# Altium project BCS1_REV2.2.PrjPcb (part 2 of 2)
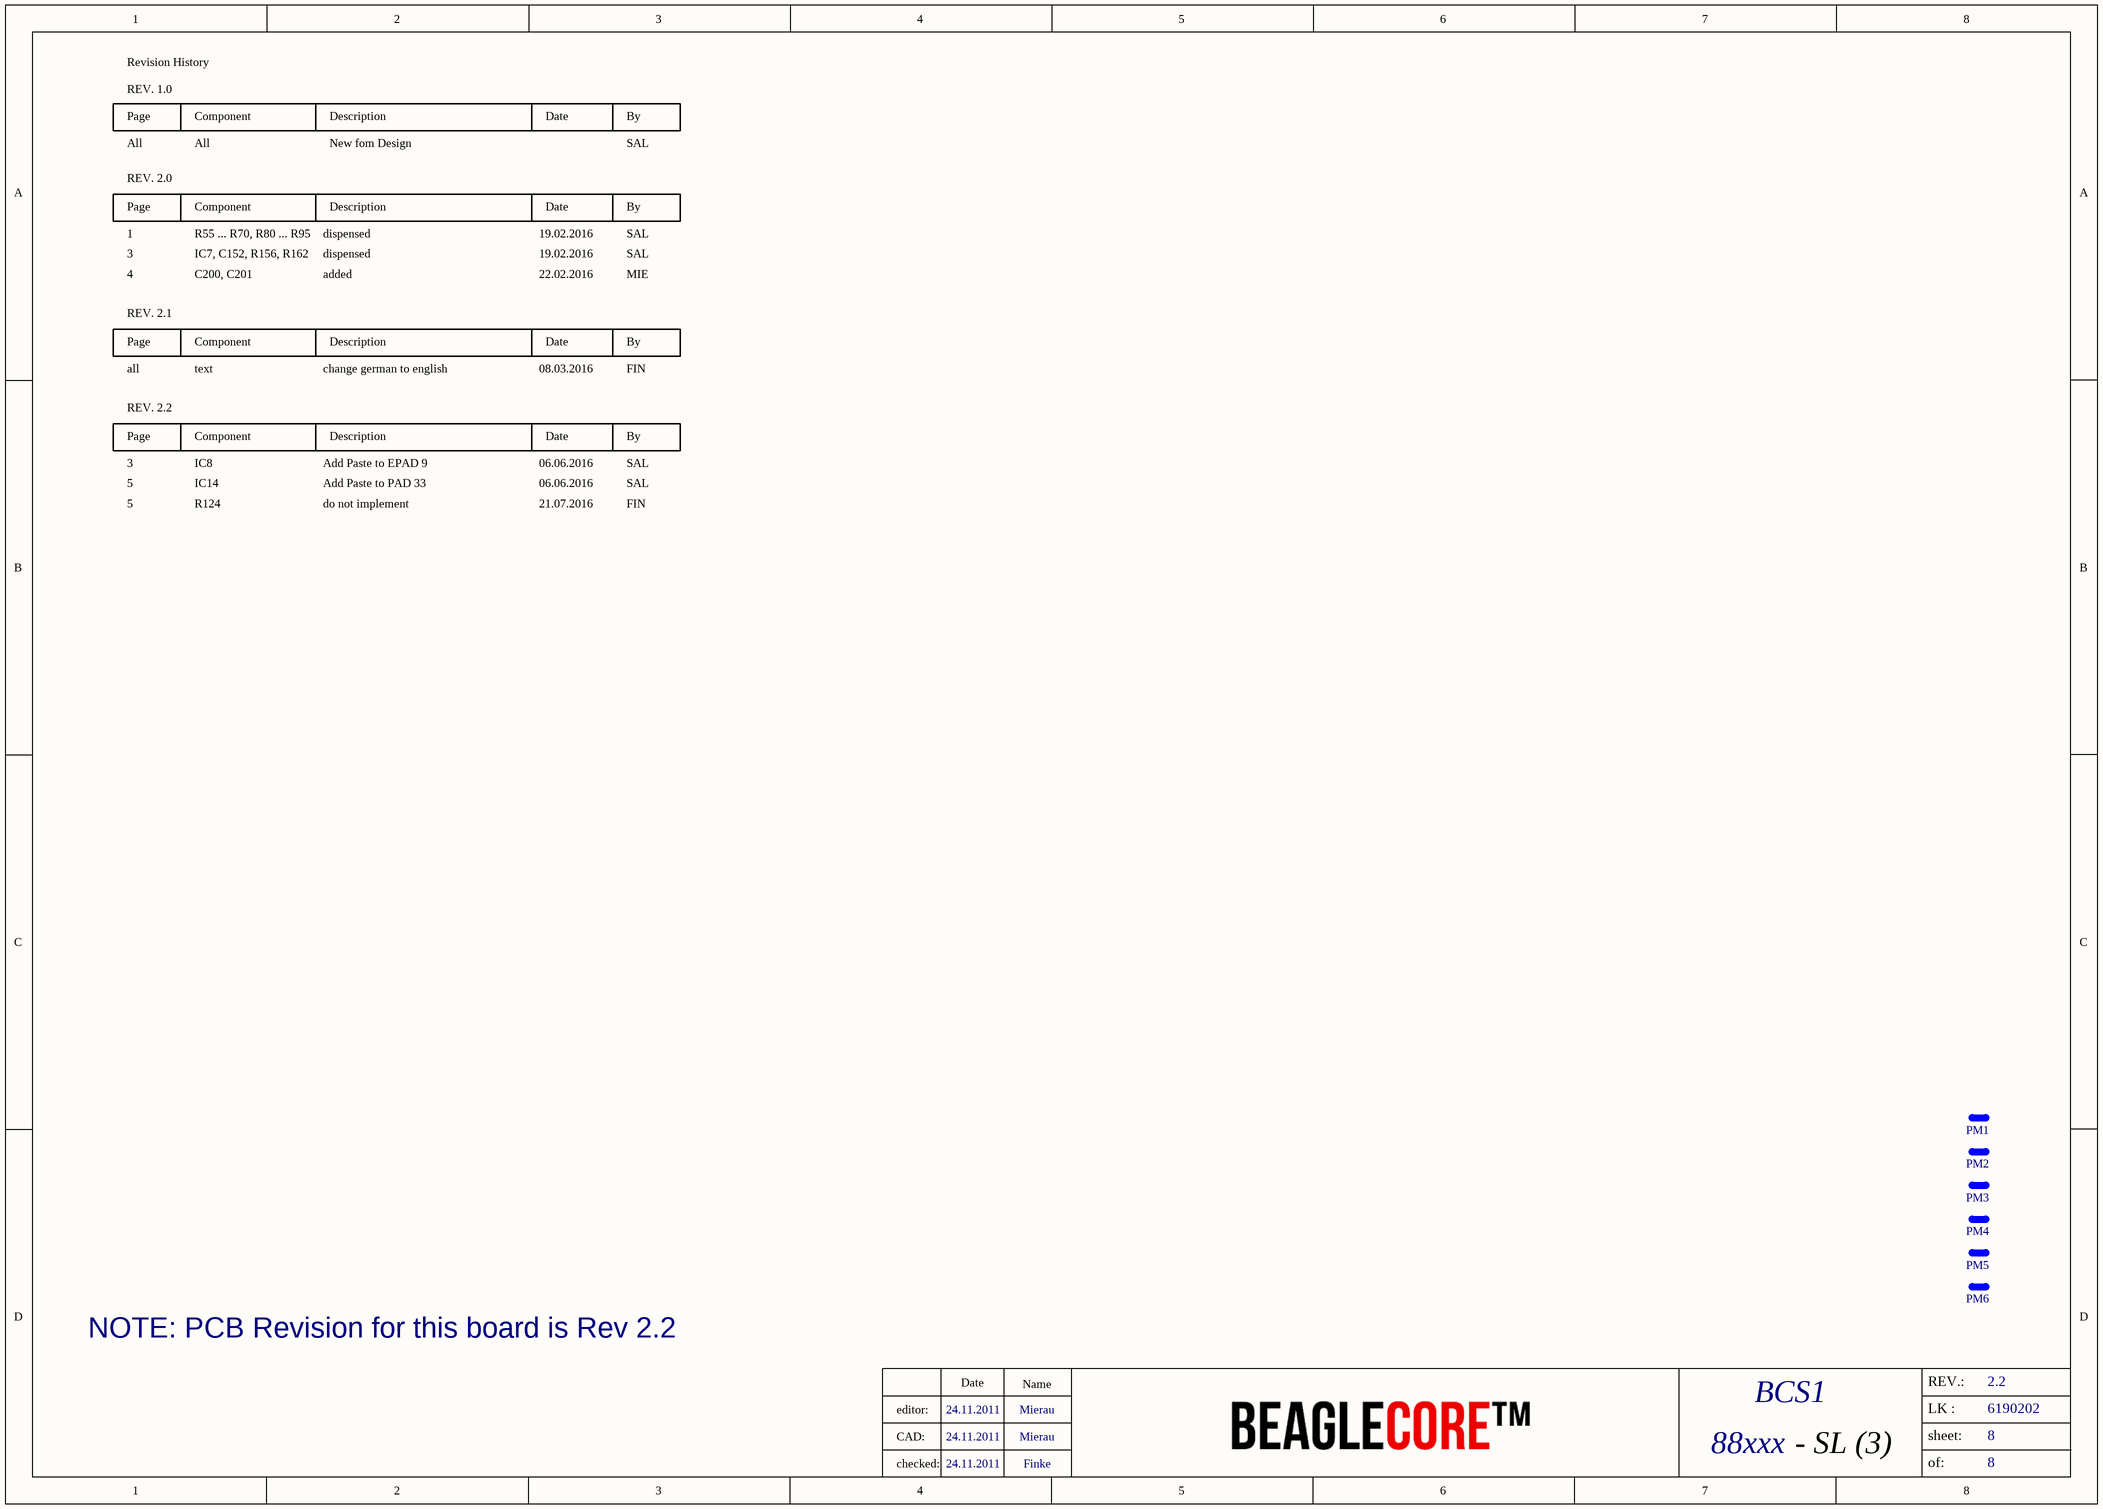
[diagram p8: P08_BCS1_Revision Page.SchDoc]

## Nets that join several sheets
DGND: P01_BCS1_Power BBCore (13 pins), P02_BCS1_JTAG, Clock, LED (23 pins), P03_BCS1_USB, Serial, uSD (20 pins), P04_BCS1_Core Connector (29 pins), P05_BCS1_Ethernet (28 pins), P06_BCS1_HDMI Framer (47 pins), P07_BCS1_Exp Conn (8 pins)
GNDA_ADC: P04_BCS1_Core Connector (BG1.55 BG1.80 BG1.G5), P07_BCS1_Exp Conn (XB9.34)
PE1: P01_BCS1_Power BBCore (BEF1.1 BEF3.1), P03_BCS1_USB, Serial, uSD (6 pins), P05_BCS1_Ethernet (R136.2 R163.2 XB5.15 XB5.16)
PE2: P01_BCS1_Power BBCore (BEF2.1 BEF4.1), P03_BCS1_USB, Serial, uSD (8 pins), P06_BCS1_HDMI Framer (XB6.20 XB6.21 XB6.22 XB6.23)
SYS_5V: P02_BCS1_JTAG, Clock, LED (R71.1 R72.1 R73.1 R74.1), P03_BCS1_USB, Serial, uSD (C34.2 IC8.2 IC8.3), P04_BCS1_Core Connector (BG1.B4), P06_BCS1_HDMI Framer (RT1.1), P07_BCS1_Exp Conn (XB9.7 XB9.8)
VDD_1V8: P04_BCS1_Core Connector (BG1.C3 BG1.C4), P06_BCS1_HDMI Framer (L3.2)
VDD_3V3A: P01_BCS1_Power BBCore (LD1.2), P02_BCS1_JTAG, Clock, LED (8 pins), P03_BCS1_USB, Serial, uSD (R52.2), P04_BCS1_Core Connector (BG1.G1)
VDD_3V3B: P02_BCS1_JTAG, Clock, LED (C29.2 R23.1 R24.1 XS2.5), P03_BCS1_USB, Serial, uSD (13 pins), P04_BCS1_Core Connector (BG1.B1 BG1.C1), P05_BCS1_Ethernet (7 pins), P06_BCS1_HDMI Framer (R158.1 R166.2), P07_BCS1_Exp Conn (XB9.3 XB9.4)
VDD_5V: P01_BCS1_Power BBCore (XS1.1), P04_BCS1_Core Connector (BG1.A4 BG1.A5), P07_BCS1_Exp Conn (XB9.5 XB9.6)
VDD_ADC: P04_BCS1_Core Connector (BG1.81 BG1.H5), P07_BCS1_Exp Conn (XB9.32)
VDD_USB_DC: P03_BCS1_USB, Serial, uSD (C36.1 DA10.6 R159.1 XB4.1), P04_BCS1_Core Connector (BG1.B5 TP23.1)
12MHZ: P02_BCS1_JTAG, Clock, LED (R21.2), P06_BCS1_HDMI Framer (IC11.27)
AIN0: P04_BCS1_Core Connector (BG1.59), P07_BCS1_Exp Conn (XB9.39)
AIN1: P04_BCS1_Core Connector (BG1.84), P07_BCS1_Exp Conn (XB9.40)
AIN2: P04_BCS1_Core Connector (BG1.58), P07_BCS1_Exp Conn (XB9.37)
AIN3: P04_BCS1_Core Connector (BG1.83), P07_BCS1_Exp Conn (XB9.38)
AIN4: P04_BCS1_Core Connector (BG1.57), P07_BCS1_Exp Conn (XB9.33)
AIN5: P04_BCS1_Core Connector (BG1.82), P07_BCS1_Exp Conn (XB9.36)
AIN6: P04_BCS1_Core Connector (BG1.56), P07_BCS1_Exp Conn (XB9.35)
BAT1: P01_BCS1_Power BBCore (TP5.1), P04_BCS1_Core Connector (BG1.60)
BAT_SENSE: P01_BCS1_Power BBCore (TP6.1), P04_BCS1_Core Connector (BG1.61)
BAT_TS: P01_BCS1_Power BBCore (TP7.1), P04_BCS1_Core Connector (BG1.62)
CLKOUT2: P02_BCS1_JTAG, Clock, LED (R19.2 R20.1 XS2.18), P07_BCS1_Exp Conn (XB9.41)
CLKOUT_SRC: P02_BCS1_JTAG, Clock, LED (R19.1), P04_BCS1_Core Connector (BG1.76)
EHRPWM1A: P04_BCS1_Core Connector (BG1.38), P07_BCS1_Exp Conn (XB9.14)
EHRPWM1B: P04_BCS1_Core Connector (BG1.39), P07_BCS1_Exp Conn (XB9.16)
EHRPWM2A: P04_BCS1_Core Connector (BG1.154), P07_BCS1_Exp Conn (XB8.19)
EHRPWM2B: P04_BCS1_Core Connector (BG1.155), P07_BCS1_Exp Conn (XB8.13)
GPIO0_7: P03_BCS1_USB, Serial, uSD (R50.1 R51.1), P07_BCS1_Exp Conn (XB9.42)
GPIO0_7SRC: P03_BCS1_USB, Serial, uSD (R50.2), P04_BCS1_Core Connector (BG1.68)
GPIO0_26: P04_BCS1_Core Connector (BG1.133), P07_BCS1_Exp Conn (XB8.14)
GPIO0_27: P04_BCS1_Core Connector (BG1.134), P07_BCS1_Exp Conn (XB8.17)
GPIO1_12: P04_BCS1_Core Connector (BG1.162), P07_BCS1_Exp Conn (XB8.12)
GPIO1_13: P04_BCS1_Core Connector (BG1.137), P07_BCS1_Exp Conn (XB8.11)
GPIO1_14: P04_BCS1_Core Connector (BG1.163), P07_BCS1_Exp Conn (XB8.16)
GPIO1_15: P04_BCS1_Core Connector (BG1.138), P07_BCS1_Exp Conn (XB8.15)
GPIO1_16: P02_BCS1_JTAG, Clock, LED (R160.2 R161.2), P07_BCS1_Exp Conn (XB9.15)
GPIO1_17: P04_BCS1_Core Connector (BG1.160), P07_BCS1_Exp Conn (XB9.23)
GPIO1_28: P04_BCS1_Core Connector (BG1.37), P07_BCS1_Exp Conn (XB9.12)
GPIO1_29: P04_BCS1_Core Connector (BG1.153), P07_BCS1_Exp Conn (XB8.26)
GPIO2_1: P04_BCS1_Core Connector (BG1.158), P07_BCS1_Exp Conn (XB8.18)
GPIO3_18: P03_BCS1_USB, Serial, uSD (R51.2), P04_BCS1_Core Connector (BG1.85)
GPIO3_19: P04_BCS1_Core Connector (BG1.86), P07_BCS1_Exp Conn (XB9.27)
GPIO3_20: P02_BCS1_JTAG, Clock, LED (R20.2), P04_BCS1_Core Connector (BG1.87)
GPIO3_21: P02_BCS1_JTAG, Clock, LED (R167.2), P04_BCS1_Core Connector (BG1.88), P07_BCS1_Exp Conn (XB9.25)
GPIO_1_16: P02_BCS1_JTAG, Clock, LED (R160.1), P04_BCS1_Core Connector (BG1.139)
GPIO_2_0: P02_BCS1_JTAG, Clock, LED (R161.1), P04_BCS1_Core Connector (BG1.159)
HDMI_INT: P04_BCS1_Core Connector (BG1.135), P06_BCS1_HDMI Framer (IC11.50 R158.2)
HDMICLK_DISn: P02_BCS1_JTAG, Clock, LED (IC9.2 R96.1), P04_BCS1_Core Connector (BG1.136)
I2C0_SCL: P04_BCS1_Core Connector (BG1.32), P06_BCS1_HDMI Framer (IC11.52)
I2C0_SDA: P04_BCS1_Core Connector (BG1.33), P06_BCS1_HDMI Framer (IC11.51)
I2C1_SCL: P04_BCS1_Core Connector (BG1.50), P07_BCS1_Exp Conn (XB9.17)
I2C1_SDA: P04_BCS1_Core Connector (BG1.49), P07_BCS1_Exp Conn (XB9.18)
I2C2_SCL: P04_BCS1_Core Connector (BG1.72), P07_BCS1_Exp Conn (XB9.19)
I2C2_SDA: P04_BCS1_Core Connector (BG1.71), P07_BCS1_Exp Conn (XB9.20)
JTAG_EMU0: P02_BCS1_JTAG, Clock, LED (R23.2 XS2.13), P04_BCS1_Core Connector (BG1.77)
JTAG_EMU1: P02_BCS1_JTAG, Clock, LED (R24.2 XS2.14), P04_BCS1_Core Connector (BG1.51)
JTAG_TCK: P02_BCS1_JTAG, Clock, LED (XS2.9 XS2.11), P04_BCS1_Core Connector (BG1.52)
JTAG_TDI: P02_BCS1_JTAG, Clock, LED (XS2.3), P04_BCS1_Core Connector (BG1.78)
JTAG_TDO: P02_BCS1_JTAG, Clock, LED (XS2.7), P04_BCS1_Core Connector (BG1.53)
JTAG_TMS: P02_BCS1_JTAG, Clock, LED (XS2.1), P04_BCS1_Core Connector (BG1.79)
JTAG_TRSTn: P02_BCS1_JTAG, Clock, LED (R25.1 XS2.2), P04_BCS1_Core Connector (BG1.54)
LCD_DATA0: P04_BCS1_Core Connector (BG1.94), P06_BCS1_HDMI Framer (C173.1 IC11.15), P07_BCS1_Exp Conn (XB8.45)
LCD_DATA1: P04_BCS1_Core Connector (BG1.111), P06_BCS1_HDMI Framer (C171.1 IC11.13), P07_BCS1_Exp Conn (XB8.46)
LCD_DATA2: P01_BCS1_Power BBCore (R75.1), P04_BCS1_Core Connector (BG1.95), P06_BCS1_HDMI Framer (C172.1 IC11.12), P07_BCS1_Exp Conn (XB8.43)
LCD_DATA3: P04_BCS1_Core Connector (BG1.112), P06_BCS1_HDMI Framer (C170.1 IC11.11), P07_BCS1_Exp Conn (XB8.44)
LCD_DATA4: P04_BCS1_Core Connector (BG1.96), P06_BCS1_HDMI Framer (C169.1 IC11.10), P07_BCS1_Exp Conn (XB8.41)
LCD_DATA5: P04_BCS1_Core Connector (BG1.113), P06_BCS1_HDMI Framer (C163.1 IC11.7), P07_BCS1_Exp Conn (XB8.42)
LCD_DATA6: P04_BCS1_Core Connector (BG1.97), P06_BCS1_HDMI Framer (C162.1 IC11.6), P07_BCS1_Exp Conn (XB8.39)
LCD_DATA7: P04_BCS1_Core Connector (BG1.114), P06_BCS1_HDMI Framer (C161.1 IC11.3), P07_BCS1_Exp Conn (XB8.40)
LCD_DATA8: P04_BCS1_Core Connector (BG1.98), P06_BCS1_HDMI Framer (C160.1 IC11.2), P07_BCS1_Exp Conn (XB8.37)
LCD_DATA9: P04_BCS1_Core Connector (BG1.115), P06_BCS1_HDMI Framer (C157.1 IC11.1), P07_BCS1_Exp Conn (XB8.38)
LCD_DATA10: P04_BCS1_Core Connector (BG1.99), P06_BCS1_HDMI Framer (C156.1 IC11.64), P07_BCS1_Exp Conn (XB8.36)
LCD_DATA11: P04_BCS1_Core Connector (BG1.116), P06_BCS1_HDMI Framer (C168.1 IC11.60), P07_BCS1_Exp Conn (XB8.34)
LCD_DATA12: P04_BCS1_Core Connector (BG1.100), P06_BCS1_HDMI Framer (C167.1 IC11.59), P07_BCS1_Exp Conn (XB8.35)
LCD_DATA13: P04_BCS1_Core Connector (BG1.117), P06_BCS1_HDMI Framer (C166.1 IC11.58), P07_BCS1_Exp Conn (XB8.33)
LCD_DATA14: P04_BCS1_Core Connector (BG1.101), P06_BCS1_HDMI Framer (C165.1 IC11.57), P07_BCS1_Exp Conn (XB8.31)
LCD_DATA15: P04_BCS1_Core Connector (BG1.118), P06_BCS1_HDMI Framer (C164.1 IC11.56), P07_BCS1_Exp Conn (XB8.32)
LCD_DE: P06_BCS1_HDMI Framer (IC11.20 R48.2), P07_BCS1_Exp Conn (XB8.30)
LCD_HSYNC: P06_BCS1_HDMI Framer (IC11.22 R47.2), P07_BCS1_Exp Conn (XB8.29)
LCD_PCLK: P06_BCS1_HDMI Framer (IC11.4 R45.2), P07_BCS1_Exp Conn (XB8.28)
LCD_VSYNC: P06_BCS1_HDMI Framer (IC11.21 R46.2), P07_BCS1_Exp Conn (XB8.27)
LCDDE: P04_BCS1_Core Connector (BG1.120), P06_BCS1_HDMI Framer (R48.1)
LCDPCLK: P04_BCS1_Core Connector (BG1.144), P06_BCS1_HDMI Framer (R45.1)
LCDVHYNC: P04_BCS1_Core Connector (BG1.145), P06_BCS1_HDMI Framer (R47.1)
LCDVSYNC: P04_BCS1_Core Connector (BG1.146), P06_BCS1_HDMI Framer (R46.1)
MDIO_CLK: P04_BCS1_Core Connector (BG1.20), P05_BCS1_Ethernet (IC14.17)
MDIO_DATA: P04_BCS1_Core Connector (BG1.19), P05_BCS1_Ethernet (IC14.16 R119.1)
MII1_COL: P04_BCS1_Core Connector (BG1.12), P05_BCS1_Ethernet (R138.1)
MII1_CRS_DV: P04_BCS1_Core Connector (BG1.28), P05_BCS1_Ethernet (R139.1)
MII1_REFCLK: P04_BCS1_Core Connector (BG1.11), P05_BCS1_Ethernet (R124.1 R140.1)
MII1_RXCLK: P04_BCS1_Core Connector (BG1.6), P05_BCS1_Ethernet (R131.1)
MII1_RXD0: P04_BCS1_Core Connector (BG1.21), P05_BCS1_Ethernet (R128.1)
MII1_RXD1: P04_BCS1_Core Connector (BG1.22), P05_BCS1_Ethernet (R127.1)
MII1_RXD2: P04_BCS1_Core Connector (BG1.4), P05_BCS1_Ethernet (R126.1)
MII1_RXD3: P04_BCS1_Core Connector (BG1.5), P05_BCS1_Ethernet (R125.1)
MII1_RXDV: P04_BCS1_Core Connector (BG1.9), P05_BCS1_Ethernet (R129.1)
MII1_RXERR: P04_BCS1_Core Connector (BG1.27), P05_BCS1_Ethernet (R133.1)
MII1_TXCLK: P04_BCS1_Core Connector (BG1.23), P05_BCS1_Ethernet (R134.1)
MII1_TXD0: P04_BCS1_Core Connector (BG1.24), P05_BCS1_Ethernet (IC14.22)
MII1_TXD1: P04_BCS1_Core Connector (BG1.7), P05_BCS1_Ethernet (IC14.23)
MII1_TXD2: P04_BCS1_Core Connector (BG1.25), P05_BCS1_Ethernet (IC14.24)
MII1_TXD3: P04_BCS1_Core Connector (BG1.8), P05_BCS1_Ethernet (IC14.25)
MII1_TXEN: P04_BCS1_Core Connector (BG1.10), P05_BCS1_Ethernet (IC14.21)
MMC0_CD: P02_BCS1_JTAG, Clock, LED (XS2.19), P03_BCS1_USB, Serial, uSD (R157.2 XB10.10), P04_BCS1_Core Connector (BG1.42)
MMC0_CLKO: P03_BCS1_USB, Serial, uSD (R152.2 XB10.5), P04_BCS1_Core Connector (BG1.65)
MMC0_CMD: P03_BCS1_USB, Serial, uSD (R151.2 XB10.3), P04_BCS1_Core Connector (BG1.64)
MMC0_DAT0: P03_BCS1_USB, Serial, uSD (R153.2 XB10.7), P04_BCS1_Core Connector (BG1.67)
MMC0_DAT1: P03_BCS1_USB, Serial, uSD (R154.2 XB10.8), P04_BCS1_Core Connector (BG1.41)
MMC0_DAT2: P03_BCS1_USB, Serial, uSD (R150.2 XB10.1), P04_BCS1_Core Connector (BG1.66)
MMC0_DAT3: P03_BCS1_USB, Serial, uSD (R155.2 XB10.2), P04_BCS1_Core Connector (BG1.40)
MMC1_CLK: P04_BCS1_Core Connector (BG1.131), P07_BCS1_Exp Conn (XB8.21)
MMC1_CMD: P04_BCS1_Core Connector (BG1.156), P07_BCS1_Exp Conn (XB8.20)
MMC1_DAT0: P04_BCS1_Core Connector (BG1.123), P07_BCS1_Exp Conn (XB8.25)
MMC1_DAT1: P04_BCS1_Core Connector (BG1.124), P07_BCS1_Exp Conn (XB8.24)
MMC1_DAT2: P04_BCS1_Core Connector (BG1.125), P07_BCS1_Exp Conn (XB8.5)
MMC1_DAT3: P04_BCS1_Core Connector (BG1.126), P07_BCS1_Exp Conn (XB8.6)
MMC1_DAT4: P04_BCS1_Core Connector (BG1.127), P07_BCS1_Exp Conn (XB8.23)
MMC1_DAT5: P04_BCS1_Core Connector (BG1.128), P07_BCS1_Exp Conn (XB8.22)
MMC1_DAT6: P04_BCS1_Core Connector (BG1.129), P07_BCS1_Exp Conn (XB8.3)
MMC1_DAT7: P04_BCS1_Core Connector (BG1.130), P07_BCS1_Exp Conn (XB8.4)
PWR_BUT: P01_BCS1_Power BBCore (TA3.2 TA3.3), P04_BCS1_Core Connector (BG1.63), P07_BCS1_Exp Conn (XB9.9)
SPI1_CS0: P04_BCS1_Core Connector (BG1.106), P06_BCS1_HDMI Framer (IC11.25), P07_BCS1_Exp Conn (XB9.28)
SPI1_D0: P04_BCS1_Core Connector (BG1.104), P06_BCS1_HDMI Framer (IC11.24), P07_BCS1_Exp Conn (XB9.29)
SPI1_D1: P04_BCS1_Core Connector (BG1.105), P07_BCS1_Exp Conn (XB9.30)
SPI1_SCLK: P04_BCS1_Core Connector (BG1.103), P06_BCS1_HDMI Framer (IC11.23), P07_BCS1_Exp Conn (XB9.31)
SYS_RESETn: P01_BCS1_Power BBCore (TA1.2 TA1.3), P02_BCS1_JTAG, Clock, LED (C30.2 XS2.15), P04_BCS1_Core Connector (BG1.48), P05_BCS1_Ethernet (IC14.19), P07_BCS1_Exp Conn (XB9.10)
TIMER4: P04_BCS1_Core Connector (BG1.148), P07_BCS1_Exp Conn (XB8.7)
TIMER5: P04_BCS1_Core Connector (BG1.149), P07_BCS1_Exp Conn (XB8.9)
TIMER6: P04_BCS1_Core Connector (BG1.150), P07_BCS1_Exp Conn (XB8.10)
TIMER7: P04_BCS1_Core Connector (BG1.151), P07_BCS1_Exp Conn (XB8.8)
UART0_RX: P03_BCS1_USB, Serial, uSD (IC15.6), P04_BCS1_Core Connector (BG1.47)
UART0_TX: P03_BCS1_USB, Serial, uSD (IC15.5), P04_BCS1_Core Connector (BG1.46)
UART1_RXD: P04_BCS1_Core Connector (BG1.73), P07_BCS1_Exp Conn (XB9.26)
UART1_TXD: P04_BCS1_Core Connector (BG1.74), P07_BCS1_Exp Conn (XB9.24)
UART2_RXD: P04_BCS1_Core Connector (BG1.69), P07_BCS1_Exp Conn (XB9.22)
UART2_TXD: P04_BCS1_Core Connector (BG1.70), P07_BCS1_Exp Conn (XB9.21)
UART4_RXD: P04_BCS1_Core Connector (BG1.36), P07_BCS1_Exp Conn (XB9.11)
UART4_TXD: P04_BCS1_Core Connector (BG1.35), P07_BCS1_Exp Conn (XB9.13)
USB0_D_N: P03_BCS1_USB, Serial, uSD (L5.1), P04_BCS1_Core Connector (BG1.2)
USB0_D_P: P03_BCS1_USB, Serial, uSD (L5.4), P04_BCS1_Core Connector (BG1.1)
USB0_ID: P03_BCS1_USB, Serial, uSD (DA10.3 XB4.4), P04_BCS1_Core Connector (BG1.167)
USB0_VBUS: P03_BCS1_USB, Serial, uSD (R159.2), P04_BCS1_Core Connector (BG1.142)
USB1_D_N: P03_BCS1_USB, Serial, uSD (L6.1), P04_BCS1_Core Connector (BG1.92)
USB1_D_P: P03_BCS1_USB, Serial, uSD (L6.4), P04_BCS1_Core Connector (BG1.91)
USB1_DRVVBUS: P03_BCS1_USB, Serial, uSD (IC8.4 R53.2), P04_BCS1_Core Connector (BG1.107)
USB1_ID: P03_BCS1_USB, Serial, uSD (R49.2), P04_BCS1_Core Connector (BG1.89)
USB1_OCn: P03_BCS1_USB, Serial, uSD (IC8.5 R52.1), P04_BCS1_Core Connector (BG1.93)
USB1_VBUS: P03_BCS1_USB, Serial, uSD (L8.1), P04_BCS1_Core Connector (BG1.109)
USR0: P02_BCS1_JTAG, Clock, LED (R76.2 T1.2), P04_BCS1_Core Connector (BG1.164)
USR1: P02_BCS1_JTAG, Clock, LED (R77.2 T1.5), P04_BCS1_Core Connector (BG1.140)
USR2: P02_BCS1_JTAG, Clock, LED (R78.2 T2.2), P04_BCS1_Core Connector (BG1.165)
USR3: P02_BCS1_JTAG, Clock, LED (R79.2 T2.5), P04_BCS1_Core Connector (BG1.141)
XDMA_EVENT_INTR0: P02_BCS1_JTAG, Clock, LED (IC6.1 XS2.17), P04_BCS1_Core Connector (BG1.43)

## Assembly variants
BB116: not fitted C137 C138 C139 C140 R124 R140 R141
BB116a: not fitted C137 C138 C139 C140 C199 IC9 R76 R77 R78 R79 R124 R136 R140 XS2 XS11